# EasyEDA Pro project Development Board F.epro, schematic Schematic1
Create Date: 2023-11-21; Page Name: P1; Project Name: Development Board F-II; Schematic Name: Schematic1; Update Date: 2023-11-21; Company: 嘉立创EDA; Page Size: B; Version: V1.0
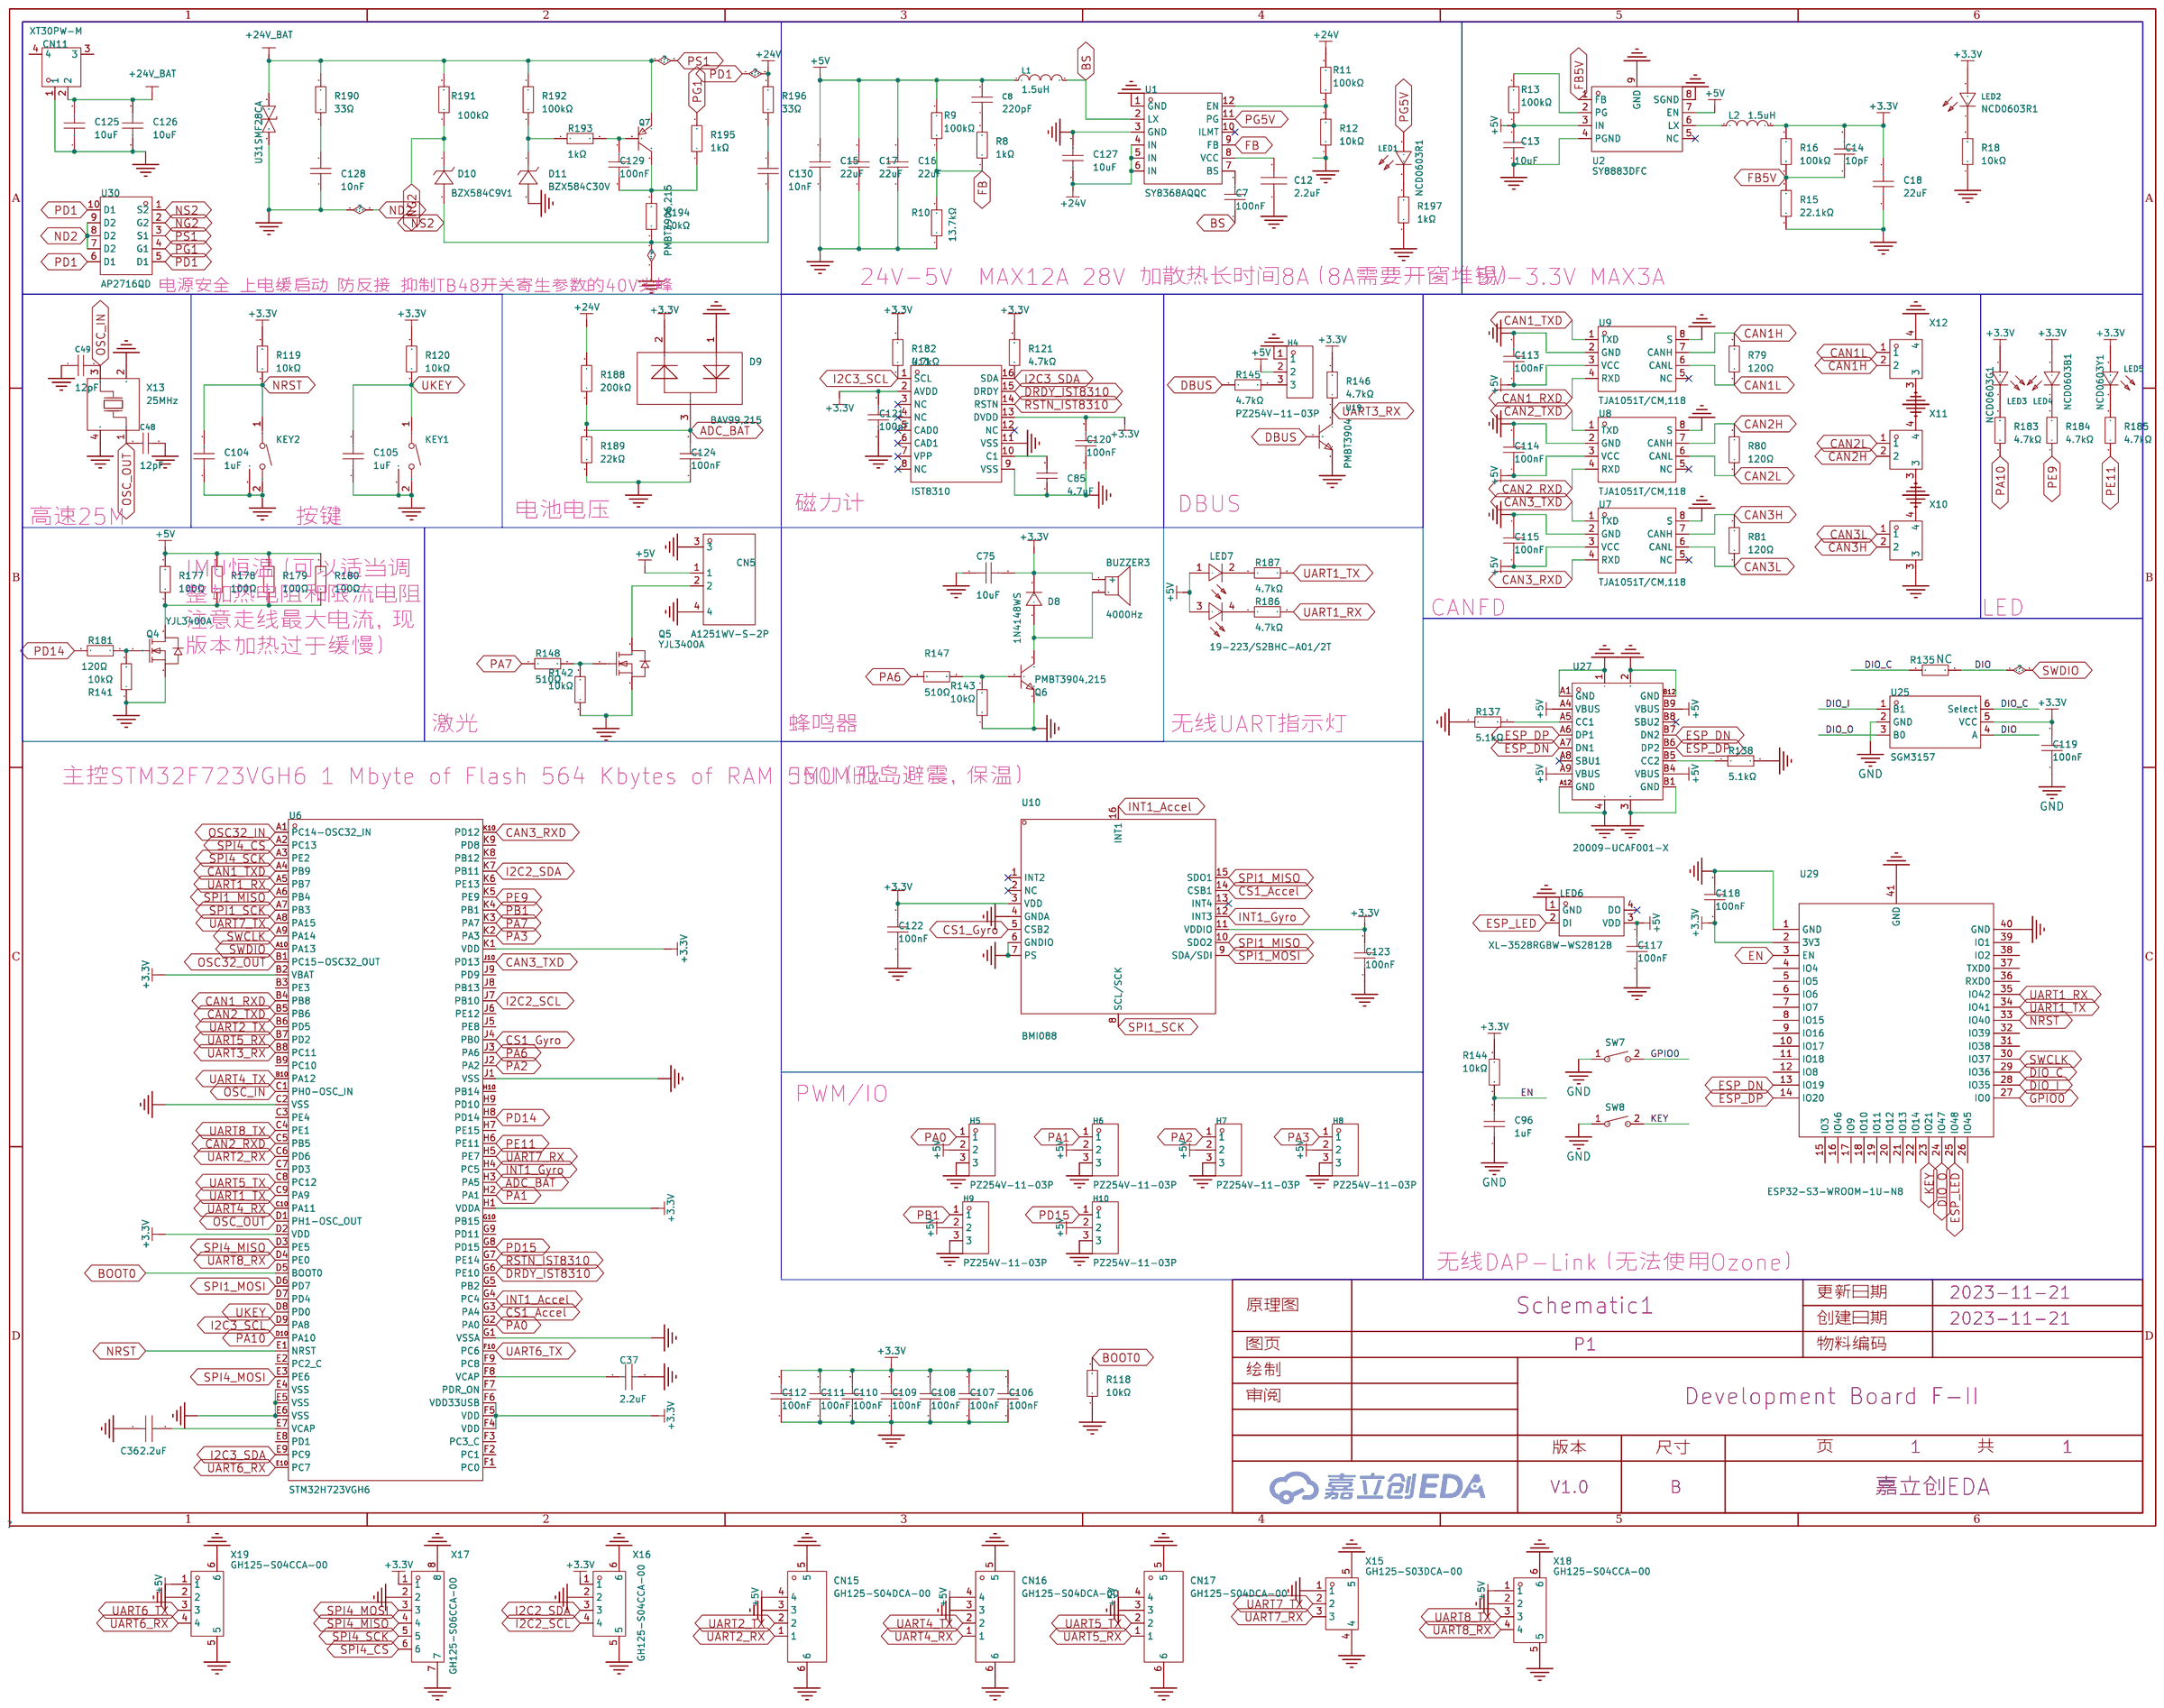
[diagram p0: schematic sheet]

## Parts
BUZZER3  4000Hz  [BUZ-SMD_L4.0-W4.0-P3.50-L]
C7  100nF  [C0402]
C8  220pF  [C0402]
C12  2.2uF  [C0402]
C13  10uF  [C0402]
C14  10pF  [C0402]
C15  22uF  [C0603]
C16  22uF  [C0603]
C17  22uF  [C0603]
C18  22uF  [C0603]
C36  2.2uF  [C0402]
C37  2.2uF  [C0402]
C48  12pF  [C0402]
C49  12pF  [C0402]
C75  10uF  [C0603]
C85  4.7uF  [C0402]
C96  1uF  [C0402]
C104  1uF  [C0402]
C105  1uF  [C0402]
C106  100nF  [C0402]
C107  100nF  [C0402]
C108  100nF  [C0402]
C109  100nF  [C0402]
C110  100nF  [C0402]
C111  100nF  [C0402]
C112  100nF  [C0402]
C113  100nF  [C0402]
C114  100nF  [C0402]
C115  100nF  [C0402]
C117  100nF  [C0402]
C118  100nF  [C0402]
C119  100nF  [C0402]
C120  100nF  [C0402]
C121  100nF  [C0402]
C122  100nF  [C0402]
C123  100nF  [C0402]
C124  100nF  [C0402]
C125  10uF  [C0805]
C126  10uF  [C0805]
C127  10uF  [C0805]
C128  10nF  [C0402]
C129  100nF  [C0402]
C130  10nF  [C0402]
CN5  A1251WV-S-2P  [CONN-SMD_2P-P1.25_A1251WV-S-2P]
CN11  XT30PW-M  [CONN-TH_XT30PW-M]
CN15  GH125-S04DCA-00  [CONN-SMD_4P-P1.27_GH125-S04DCA-00]
CN16  GH125-S04DCA-00  [CONN-SMD_4P-P1.27_GH125-S04DCA-00]
CN17  GH125-S04DCA-00  [CONN-SMD_4P-P1.27_GH125-S04DCA-00]
D8  1N4148WS  [SOD-323_L1.8-W1.3-LS2.5-RD]
D9  BAV99,215  [SOT-23-3_L2.9-W1.6-P1.90-LS2.8-BR]
D10  BZX584C9V1  [ESC_L1.2-W0.8-LS1.6-RD]
D11  BZX584C30V  [SOD-523_L1.2-W0.8-LS1.6-RD]
H4  PZ254V-11-03P  [HDR-TH_3P-P2.54-V-M]
H5  PZ254V-11-03P  [HDR-TH_3P-P2.54-V-M]
H6  PZ254V-11-03P  [HDR-TH_3P-P2.54-V-M]
H7  PZ254V-11-03P  [HDR-TH_3P-P2.54-V-M]
H8  PZ254V-11-03P  [HDR-TH_3P-P2.54-V-M]
H9  PZ254V-11-03P  [HDR-TH_3P-P2.54-V-M]
H10  PZ254V-11-03P  [HDR-TH_3P-P2.54-V-M]
KEY1  1TS003B-2500-3500A-CT  [KEY-SMD_1TS003B-2500-3500A-CT]
KEY2  1TS003B-2500-3500A-CT  [KEY-SMD_1TS003B-2500-3500A-CT]
L1  1.5uH  [IND-SMD_L7.0-W6.6]
L2  1.5uH  [L0806]
LED1  NCD0603R1  [LED0603-RD_RED]
LED2  NCD0603R1  [LED0603-RD_RED]
LED3  NCD0603G1  [LED0603-RD]
LED4  NCD0603B1  [LED0603-RD]
LED5  NCD0603Y1  [LED0603-RD]
LED6  XL-3528RGBW-WS2812B  [LED-SMD_4P-L3.5-W2.8-BR-1]
LED7  19-223/S2BHC-A01/2T  [LED-ARRAY-SMD_4P-L1.6-W1.5-BR_19-223]
Q4  YJL3400A  [SOT-23-3_L2.9-W1.3-P1.90-LS2.4-BR]
Q5  YJL3400A  [SOT-23-3_L2.9-W1.3-P1.90-LS2.4-BR]
Q6  PMBT3904,215  [SOT-23_L2.9-W1.3-P1.90-LS2.4-BR]
Q7  PMBT3906,215  [SOT-23-3_L2.9-W1.3-P1.90-LS2.4-BR]
R8  1kΩ  [R0402]
R9  100kΩ  [R0402]
R10  13.7kΩ  [R0402]
R11  100kΩ  [R0402]
R12  10kΩ  [R0402]
R13  100kΩ  [R0402]
R15  22.1kΩ  [R0402]
R16  100kΩ  [R0402]
R18  10kΩ  [R0402]
R79  120Ω  [R0402]
R80  120Ω  [R0402]
R81  120Ω  [R0402]
R118  10kΩ  [R0402]
R119  10kΩ  [R0402]
R120  10kΩ  [R0402]
R121  4.7kΩ  [R0402]
R135  NC  [R0402]
R137  5.1kΩ  [R0402]
R138  5.1kΩ  [R0402]
R141  10kΩ  [R0402]
R142  10kΩ  [R0402]
R143  10kΩ  [R0402]
R144  10kΩ  [R0402]
R145  4.7kΩ  [R0402]
R146  4.7kΩ  [R0402]
R147  510Ω  [R0402]
R148  510Ω  [R0402]
R177  100Ω  [R0603]
R178  100Ω  [R0603]
R179  100Ω  [R0603]
R180  100Ω  [R0603]
R181  120Ω  [R0402]
R182  4.7kΩ  [R0402]
R183  4.7kΩ  [R0402]
R184  4.7kΩ  [R0402]
R185  4.7kΩ  [R0402]
R186  4.7kΩ  [R0402]
R187  4.7kΩ  [R0402]
R188  200kΩ  [R0402]
R189  22kΩ  [R0402]
R190  33Ω  [R0402]
R191  100kΩ  [R0402]
R192  100kΩ  [R0402]
R193  1kΩ  [R0402]
R194  10kΩ  [R0402]
R195  1kΩ  [R0402]
R196  33Ω  [R0402]
R197  1kΩ  [R0402]
SW7  TS-1185-C-A-A-A  [SW-SMD_L4.0-W3.0-LS5.0-EH]
SW8  TS-1185-C-A-A-A  [SW-SMD_L4.0-W3.0-LS5.0-EH]
U1  SY8368AQQC  [QFN-12_L3.0-W3.0-P0.45-TL-EP]
U2  SY8883DFC  [WDFN-8_L2.0-W2.0-P0.50-BL-EP]
U6  STM32H723VGH6  [TFBGA-100_L8.0-W8.0-R10-C10-P0.80-BL]
U7  TJA1051T/CM,118  [SOIC-8_L5.0-W4.0-P1.27-LS6.1-BL]
U8  TJA1051T/CM,118  [SOIC-8_L5.0-W4.0-P1.27-LS6.1-BL]
U9  TJA1051T/CM,118  [SOIC-8_L5.0-W4.0-P1.27-LS6.1-BL]
U10  BMI088  [LGA-16_L4.5-W3.0-P0.50-BL]
U11  IST8310  [LGA-16_L3.0-W3.0-P0.5-BL]
U19  PMBT3904  [SOT-23-3_L2.9-W1.3-P1.90-LS2.4-BR]
U25  SGM3157  [SC-70-6_L2.2-W1.3-P0.65-LS2.1-BL]
U27  20009-UCAF001-X  [TYPE-C-SMD_20009-UCAF001-X]
U29  ESP32-S3-WROOM-1U-N8  [WIRELM-SMD_ESP32-S3-WROOM-1U]
U30  AP2716QD  [PDFN-8_L3.2-W3.1-P0.65-LS3.4-BL-EP2]
U31  SMF28CA  [SOD-123FL_L2.8-W1.8-LS3.7-BI]
X10  GH125-S02DCA-00  [CONN-SMD_2P-P1.25_JUSHUO_GH125-S02DCA-00]
X11  GH125-S02DCA-00  [CONN-SMD_2P-P1.25_JUSHUO_GH125-S02DCA-00]
X12  GH125-S02DCA-00  [CONN-SMD_2P-P1.25_JUSHUO_GH125-S02DCA-00]
X13  25MHz  [OSC-SMD_4P-L3.2-W2.5-BL]
X15  GH125-S03DCA-00  [CONN-SMD_3P-P1.25_JUSHUO_GH125-S03DCA-00]
X16  GH125-S04CCA-00  [CONN-SMD_4P-P1.25_JS_GH125-S04CCA-00]
X17  GH125-S06CCA-00  [CONN-SMD_6P-P1.25_JS_GH125-S06CCA-00]
X18  GH125-S04CCA-00  [CONN-SMD_4P-P1.25_JS_GH125-S04CCA-00]
X19  GH125-S04CCA-00  [CONN-SMD_4P-P1.25_JS_GH125-S04CCA-00]

## Library data of the parts
BUZZER3 = FUET-4020: 驱动方式:无源(外部驱动);构造类型:电磁式;额定电压:3V;工作电压:2V~4V;频率:4000Hz;声压(SPL):65dB@3V,10cm;长度:4mm;宽度:4mm;高度:2.5mm;; LCSC Part Name: 电压 3V 频率 4KHZ; Supplier Part: C391027; Manufacturer: FUET(福声科技); Supplier Footprint: SMD; JLCPCB Part Class: 扩展库; Datasheet: https://atta.szlcsc.com/upload/public/pdf/source/20191031/C391027_1FC1E5FCD05180B5ABC7B83EB3465454.pdf; Supplier: LCSC; Oscillator Circuit: 无源(外部驱动); Technology Type: 电磁式; Rated Voltage: 3V; Operating Voltage: 2V~4V; Sound Pressure Level (SPL): 65dB@3V,10cm; Length: 4mm; Width: 4mm; Height: 2.5mm
C7 C106-C115 C117-C124 C129 = CL05B104KB54PNC: 容值:100nF;精度:±10%;额定电压:50V;材质(温度系数):X7R;; LCSC Part Name: 100nF ±10% 50V; Supplier Part: C307331; Manufacturer: SAMSUNG(三星); Supplier Footprint: 0402; JLCPCB Part Class: 基础库; Datasheet: https://atta.szlcsc.com/upload/public/pdf/source/20181009/C307331_222F7C870FD3EA5F46F538B483443886.pdf; Supplier: LCSC; Tolerance: ±10%; Voltage Rated: 50V; Temperature Coefficient: X7R
C8 = 0402B221K500NT: 容值:220pF;精度:±10%;额定电压:50V;材质(温度系数):X7R;; LCSC Part Name: 220pF ±10% 50V; Supplier Part: C1530; Manufacturer: FH(风华); Supplier Footprint: 0402; JLCPCB Part Class: 基础库; Datasheet: https://atta.szlcsc.com/upload/public/pdf/source/20200305/C486355_26A10D38EF8C2A5C37091D0039909270.pdf; Supplier: LCSC; Tolerance: ±10%; Voltage Rated: 50V; Temperature Coefficient: X7R
C12 = CL05A225MQ5NSNC: 容值:2.2uF;精度:±20%;额定电压:6.3V;材质(温度系数):X5R;; LCSC Part Name: 2.2uF ±20% 6.3V; Supplier Part: C12530; Manufacturer: SAMSUNG(三星); Supplier Footprint: 0402; JLCPCB Part Class: 基础库; Datasheet: https://atta.szlcsc.com/upload/public/pdf/source/20160103/1457707666860.pdf; Supplier: LCSC; Tolerance: ±20%; Voltage Rated: 6.3V; Temperature Coefficient: X5R
C13 = CL05A106MQ5NUNC: 容值:10uF;精度:±20%;额定电压:6.3V;材质(温度系数):X5R;; LCSC Part Name: 10uF ±20% 6.3V; Supplier Part: C15525; Manufacturer: SAMSUNG(三星); Supplier Footprint: 0402; JLCPCB Part Class: 基础库; Datasheet: https://atta.szlcsc.com/upload/public/pdf/source/20220823/2B02EE04F8F211D38A52DCB16EB6BEBA.pdf; Supplier: LCSC; Tolerance: ±20%; Voltage Rated: 6.3V; Temperature Coefficient: X5R
C14 = CL05C100JB5NNNC: 容值:10pF;精度:±5%;额定电压:50V;材质(温度系数):C0G;; LCSC Part Name: 10pF ±5% 50V; Supplier Part: C32949; Manufacturer: SAMSUNG(三星); Supplier Footprint: 0402; JLCPCB Part Class: 基础库; Datasheet: https://atta.szlcsc.com/upload/public/pdf/source/20160103/1457707722238.pdf; Supplier: LCSC; Tolerance: ±5%; Voltage Rated: 50V; Temperature Coefficient: C0G
C15-C18 = CL10A226MQ8NRNC: 容值:22uF;精度:±20%;额定电压:6.3V;材质(温度系数):X5R;; LCSC Part Name: 22uF ±20% 6.3V; Supplier Part: C59461; Manufacturer: SAMSUNG(三星); Supplier Footprint: 0603; JLCPCB Part Class: 基础库; Datasheet: https://atta.szlcsc.com/upload/public/pdf/source/20160218/1457707763339.pdf; Supplier: LCSC; Tolerance: ±20%; Voltage Rated: 6.3V; Temperature Coefficient: X5R
C36 C37 = CL05A225MQ5NSNC: 容值:2.2uF;精度:±20%;额定电压:6.3V;材质(温度系数):X5R;; LCSC Part Name: 2.2uF ±20% 6.3V; Supplier Part: C12530; Manufacturer: SAMSUNG(三星); Supplier Footprint: 0402; JLCPCB Part Class: Basic Part; Datasheet: https://atta.szlcsc.com/upload/public/pdf/source/20160103/1457707666860.pdf; Supplier: LCSC; Tolerance: ±20%; Voltage Rated: 6.3V; Temperature Coefficient: X5R
C48 C49 = 0402CG120J500NT: 容值:12pF;精度:±5%;额定电压:50V;材质(温度系数):C0G;; LCSC Part Name: 12pF ±5% 50V; Supplier Part: C1547; Manufacturer: FH(风华); Supplier Footprint: 0402; JLCPCB Part Class: Basic Part; Datasheet: https://atta.szlcsc.com/upload/public/pdf/source/20200305/C486355_26A10D38EF8C2A5C37091D0039909270.pdf; Supplier: LCSC; Tolerance: ±5%; Voltage Rated: 50V; Temperature Coefficient: C0G
C75 = CL10A106MA8NRNC: 容值:10uF;精度:±20%;额定电压:25V;材质(温度系数):X5R;; LCSC Part Name: 10uF ±20% 25V; Supplier Part: C96446; Manufacturer: SAMSUNG(三星); Supplier Footprint: 0603; JLCPCB Part Class: 基础库; Datasheet: https://atta.szlcsc.com/upload/public/pdf/source/20170325/1490427913016.pdf; Supplier: LCSC; Tolerance: ±20%; Voltage Rated: 25V; Temperature Coefficient: X5R
C85 = CL05A475MP5NRNC: 容值:4.7uF;精度:±20%;额定电压:10V;材质(温度系数):X5R;; LCSC Part Name: 4.7uF ±20% 10V; Supplier Part: C23733; Manufacturer: SAMSUNG(三星); Supplier Footprint: 0402; JLCPCB Part Class: 基础库; Datasheet: https://atta.szlcsc.com/upload/public/pdf/source/20160103/1457707710457.pdf; Supplier: LCSC; Tolerance: ±20%; Voltage Rated: 10V; Temperature Coefficient: X5R
C96 C104 C105 = CL05A105KA5NQNC: 容值:1uF;精度:±10%;额定电压:25V;材质(温度系数):X5R;; LCSC Part Name: 1uF ±10% 25V; Supplier Part: C52923; Manufacturer: SAMSUNG(三星); Supplier Footprint: 0402; JLCPCB Part Class: 基础库; Datasheet: https://atta.szlcsc.com/upload/public/pdf/source/20160103/1457707735223.pdf; Supplier: LCSC; Tolerance: ±10%; Voltage Rated: 25V; Temperature Coefficient: X5R
C125-C127 = GRM21BR61H106KE43L: 容值:10uF;精度:±10%;额定电压:50V;材质(温度系数):X5R;; LCSC Part Name: 10uF ±10% 50V; Supplier Part: C440198; Manufacturer: muRata(村田); Supplier Footprint: 0805; JLCPCB Part Class: 基础库; Datasheet: https://atta.szlcsc.com/upload/public/pdf/source/20191220/C440198_2DEA1B9834E321C8893F7972E9DFE5B0.pdf; Supplier: LCSC; Tolerance: ±10%; Voltage Rated: 50V; Temperature Coefficient: X5R
C128 C130 = CL05B103KB5NNNC: 容值:10nF;精度:±10%;额定电压:50V;材质(温度系数):X7R;; LCSC Part Name: 10nF ±10% 50V; Supplier Part: C15195; Manufacturer: SAMSUNG(三星); Supplier Footprint: 0402; JLCPCB Part Class: 基础库; Datasheet: https://atta.szlcsc.com/upload/public/pdf/source/20160103/1457707674468.pdf; Supplier: LCSC; Tolerance: ±10%; Voltage Rated: 50V; Temperature Coefficient: X7R
CN5 = A1251WV-S-2P: 参考系列:-;间距:1.25mm;插针结构:1x2P;排数:1;每排PIN数:2;行距:-;安装方式:-;触头材质:磷青铜;; LCSC Part Name: 1.25mm 1x2P 镀锡; Supplier Part: C225104; Manufacturer: CJT(长江连接器); Supplier Footprint: SMD,P=1.25mm; JLCPCB Part Class: 扩展库; Datasheet: https://atta.szlcsc.com/upload/public/pdf/source/20180509/C225104_35B4868FFB7D8A864E1EEFC552D9B5A2.pdf; Supplier: LCSC; Pitch: 1.25mm; Pins Structure: 1x2P; Number of Rows: 1; Number of PINs Per Row: 2; Contact Material: 磷青铜
CN11 = XT30PW-M: Socket,DCsupply,XT30,male,PIN:2; LCSC Part Name: AMASS(艾迈斯)航模插头 卧式弯脚 XT30PW-M公头; Supplier Part: C431092; Manufacturer: AMASS(艾迈斯); JLCPCB Part Class: Extended Part; Datasheet: https://atta.szlcsc.com/upload/public/pdf/source/20220222/6A9F22F7850E25B33E1BE430ADF8560B.pdf; Supplier: LCSC
CN15-CN17 = GH125-S04DCA-00: 参考系列:-;间距:1.25mm;插针结构:1x4P;排数:1;每排PIN数:4;行距:-;公母:公型插针;安装方式:卧贴;额定电流:1A;工作温度范围:-25℃~+85℃;; LCSC Part Name: GH1.25卧式贴片 带扣; Supplier Part: C2886767; Manufacturer: JS(钜硕电子); Supplier Footprint: SMD,P=1.25mm; JLCPCB Part Class: 扩展库; Datasheet: https://atta.szlcsc.com/upload/public/pdf/source/20210818/CD11791E5ED3EDF45A7009E9C8A2BD4C.pdf; Supplier: LCSC; Pitch: 1.25mm; Pins Structure: 1x4P; Number of Rows: 1; Number of PINs Per Row: 4; Gender: 公型插针; Mounting Style: 卧贴; Current Rating (Max): 1A; Operating Temperature Range: -25℃~+85℃
D8 = 1N4148WS_C2128: 二极管配置:独立式;功率:200mW;直流反向耐压(Vr):100V;平均整流电流(Io):150mA;正向压降(Vf):1.25V@150mA;反向电流(Ir):1uA@75V;反向恢复时间(trr):4ns;工作温度:+150℃@(Tj);; LCSC Part Name: 100V 150mA 4ns T4; Supplier Part: C2128; Manufacturer: CJ(江苏长电/长晶); Supplier Footprint: SOD-323; JLCPCB Part Class: 基础库; Datasheet: https://atta.szlcsc.com/upload/public/pdf/source/20140809/1457707208178.pdf; Supplier: LCSC; Diode Configuration: 独立式; Power Dissipation: 200mW; Reverse Voltage (Vr): 100V; Average Rectified Current (Io): 150mA; Forward Voltage (Vf@If): 1.25V@150mA; Reverse Leakage Current: 1uA@75V; Reverse Recovery Time (trr): 4ns; Operating Temperature: +150℃@(Tj)
D9 = BAV99,215: 二极管配置:1对串联式;功率:250mW;直流反向耐压(Vr):100V;平均整流电流(Io):215mA;正向压降(Vf):1.25V@150mA;反向恢复时间(trr):4ns;; LCSC Part Name: 100V 215mA 1.25V@150mA; Supplier Part: C2500; Manufacturer: Nexperia(安世); Supplier Footprint: SOT-23; JLCPCB Part Class: 基础库; Datasheet: https://atta.szlcsc.com/upload/public/pdf/source/20151007/1457707426030.pdf; Supplier: LCSC; Diode Configuration: 1对串联式; Power Dissipation: 250mW; Reverse Voltage (Vr): 100V; Average Rectified Current (Io): 215mA; Forward Voltage (Vf@If): 1.25V@150mA; Reverse Leakage Current: 500nA@80V; Reverse Recovery Time (trr): 4ns; Operating Temperature: +150℃@(Tj)
D10 = BZX584C9V1: 二极管配置:独立式;稳压值(标称值):9.1V;稳压值(范围):8.5V~9.6V;精度:-;功率:200mW;反向电流(Ir):200nA@7V;阻抗(Zzt):15Ω;; LCSC Part Name: 9.1V 200mW; Supplier Part: C968211; Manufacturer: YANGJIE(扬杰); Supplier Footprint: SOD-523; JLCPCB Part Class: 扩展库; Datasheet: https://atta.szlcsc.com/upload/public/pdf/source/20201222/C968180_8DEF4A0FE776E72B62938E062B6263B6.pdf; Supplier: LCSC; Diode Configuration: 独立式; Zener Voltage (Nom): 9.1V; Zener Voltage (Range): 8.5V~9.6V; Power Dissipation: 200mW; Reverse Leakage Current (Ir): 200nA@7V; Zener Impedance (Zzt): 15Ω
D11 = BZX584C30V: 二极管配置:独立式;稳压值(标称值):30V;稳压值(范围):28V~32V;精度:-;功率:200mW;反向电流(Ir):50nA@21V;阻抗(Zzt):80Ω;; LCSC Part Name: 30V 200mW; Supplier Part: C968193; Manufacturer: YANGJIE(扬杰); Supplier Footprint: SOD-523; JLCPCB Part Class: 扩展库; Datasheet: https://atta.szlcsc.com/upload/public/pdf/source/20201222/C968180_8DEF4A0FE776E72B62938E062B6263B6.pdf; Supplier: LCSC; Diode Configuration: 独立式; Zener Voltage (Nom): 30V; Zener Voltage (Range): 28V~32V; Power Dissipation: 200mW; Reverse Leakage Current (Ir): 50nA@21V; Zener Impedance (Zzt): 80Ω
H4-H10 = PZ254V-11-03P: 排数:单排;总PIN位数:3;间距:2.54mm;插针结构:1x3P;行距:-;安装类型:直插;圆针/方针:方针;额定电流:3A;额定电压:250V;配合针长度:6mm;塑高:2.5mm;端接针长度:3mm;工作温度范围:-40℃~+105℃;颜色:黑色;; LCSC Part Name: 2.54mm 1x3P 直插 方针; Supplier Part: C2937625; Manufacturer: XFCN(兴飞); Supplier Footprint: 直插,P=2.54mm; JLCPCB Part Class: 扩展库; Datasheet: 2022-07-12/581362A/62b9d00620994b3696be7eb4af85ad72/双排排针和单排排针.pdf; Supplier: LCSC; Number of Rows: 单排; Number of Pins: 3; Pitch: 2.54mm; Pin Structure: 1x3P; Mounting Type: 直插; Circluar Pins/Square Pins: 方针; Current Rating (Max): 3A; Voltage Rating (Max): 250V; Length of Mating Pin: 6mm; Insulation Height: 2.5mm; Length of End Connection Pin: 3mm; Operating Temperature Range: -40℃~+105℃; Color: 黑色
KEY1 KEY2 = 1TS003B-2500-3500A-CT: 触点电流:50mA;额定电压(DC):12V;额定功率:0.6W;绝缘电阻:100MΩ;电路结构:单刀单掷;安装方式:卧贴;带灯:无;作用力:250gf@±50gf;机械寿命:1.5万次;带支架:否;; LCSC Part Name: 4.6*1.82*3.5mm 卧贴 轻触开关; Supplier Part: C255810; Manufacturer: HYP(鸿源精密); Supplier Footprint: SMD,2x4mm; JLCPCB Part Class: 扩展库; Datasheet: https://atta.szlcsc.com/upload/public/pdf/source/20180720/C255810_F77B30B42331AEA91D48A1AA0FBA2945.pdf; Supplier: LCSC; Contact Current: 50mA; Voltage Rating (DC): 12V; Power Rating: 0.6W; Insulation Resistance: 100MΩ; Circuit: 单刀单掷; Mounting Style: 卧贴; Actuator Style: 矩形按钮; Actuator/Cap Color: 黑色; With Lamp: 无; Operating Force: 250gf@±50gf; Mechanical Life: 1.5万次; Operating Temperature: -40℃~+90℃; Pin Style: J型引脚; Switch Length: 4.6mm; Switch Width: 1.82mm; Switch Height: 3.5mm; Strike Gundam: 否
L1 = FXL0624-1R5-M: 类型:一体成型电感;电感值:1.5uH;精度:±20%;额定电流:9A;饱和电流(Isat):15A;; LCSC Part Name: 1.5uH ±20% 15A; Supplier Part: C524603; Manufacturer: cjiang(长江微电); Supplier Footprint: SMD,6.6x7mm; JLCPCB Part Class: 扩展库; Datasheet: https://atta.szlcsc.com/upload/public/pdf/source/20230516/0866C3D179493295F2274FDF9DB6F780.pdf; Supplier: LCSC; Type: 一体成型电感; Tolerance: ±20%; Rated Current: 9A; Saturation Current (Isat): 15A; DC Resistance (DCR): 20mΩ
L2 = DFE201610E-1R5M=P2: 电感值:1.5uH;精度:±20%;额定电流:-;饱和电流(Isat):-;; LCSC Part Name: 1.5uH ±20%; Supplier Part: C668311; Manufacturer: muRata(村田); Supplier Footprint: SMD; JLCPCB Part Class: 扩展库; Datasheet: https://atta.szlcsc.com/upload/public/pdf/source/20190513/C337891_E8F53E7A275D0CF4365E41AA9943B04D.pdf; Supplier: LCSC; Tolerance: ±20%
LED1 LED2 = NCD0603R1_C84263: 发光颜色:红灯;; LCSC Part Name: 红灯 0603红灯   正贴; Supplier Part: C84263; Manufacturer: 国星光电; Supplier Footprint: 0603; JLCPCB Part Class: 扩展库; Datasheet: https://atta.szlcsc.com/upload/public/pdf/source/20200820/C84263_DABC6A75E58F576973B407FDBA283D60.pdf; Supplier: LCSC; Emitted Color: 红灯
LED3 = NCD0603G1: 发光颜色:翠绿;; LCSC Part Name: 翠绿 0603翠绿  正贴; Supplier Part: C84267; Manufacturer: 国星光电; Supplier Footprint: 0603; JLCPCB Part Class: 扩展库; Datasheet: https://atta.szlcsc.com/upload/public/pdf/source/20200820/C84267_04BA7703640BAC111D09F5EFB971FBF3.pdf; Supplier: LCSC; Emitted Color: 翠绿
LED4 = NCD0603B1: 发光颜色:蓝灯;; LCSC Part Name: 蓝灯; Supplier Part: C84266; Manufacturer: 国星光电; Supplier Footprint: 0603; JLCPCB Part Class: 扩展库; Datasheet: https://atta.szlcsc.com/upload/public/pdf/source/20200820/C84266_6A3CDBEFA72C6CAD68EDA53474ADAE6C.pdf; Supplier: LCSC; Emitted Color: 蓝灯
LED5 = NCD0603Y1: 发光颜色:黄灯;; Supplier Part: C84268; Manufacturer: 国星光电; Supplier Footprint: 0603; JLCPCB Part Class: 扩展库; Datasheet: https://atta.szlcsc.com/upload/public/pdf/source/20200820/C84268_8FC106CB292CF978F9CFC6892464F83C.pdf; Supplier: LCSC; Emitted Color: 黄灯
LED6 = XL-3528RGBW-WS2812B: 发光颜色:RGB三色;二极管配置:-;主波长:618nm~623nm；520nm~525nm；467nm~472nm;功率:50mW；50mW；45mW;安装方式:正贴;; LCSC Part Name: RGB三色 正贴 幻彩; Supplier Part: C2890364; Manufacturer: XINGLIGHT(成兴光); Supplier Footprint: SMD3528-4P; JLCPCB Part Class: 扩展库; Datasheet: https://atta.szlcsc.com/upload/public/pdf/source/20221102/50F456983F591359B0D81AA557777463.pdf; Supplier: LCSC; Emitted Color: RGB三色; Dominant Wavelength: 618nm~623nm；520nm~525nm；467nm~472nm; Peak Wavelength: 525nm；623nm；472nm; Forward Current: 20mA; Power Dissipation: 50mW；50mW；45mW; Viewing Angle: 120°; Mounting Sytle: 正贴; Operating Temperature: -25℃~+80℃
LED7 = 19-223/S2BHC-A01/2T: 发光颜色:橙灯,蓝灯;二极管配置:-;透镜颜色:无色透明;主波长:470nm；605nm;色温:-;功率:60mW；75mW;发光角度:120°;安装方式:-;工作温度:-40℃~+85℃;; LCSC Part Name: 橙灯,蓝灯; Supplier Part: C883171; Manufacturer: EVERLIGHT(亿光); Supplier Footprint: 0606; JLCPCB Part Class: 扩展库; Datasheet: https://atta.szlcsc.com/upload/public/pdf/source/20201103/C883171_5F9DC7D6FE738F23ABB8905D22F05F10.pdf; Supplier: LCSC; Emitted Color: 橙灯,蓝灯; Lens Color: 无色透明; Dominant Wavelength: 470nm；605nm; Peak Wavelength: 611nm；468nm; Forward Current: 20mA; Power Dissipation: 60mW；75mW; Viewing Angle: 120°; Operating Temperature: -40℃~+85℃
Q4 Q5 = YJL3400A: 类型:N沟道;漏源电压(Vdss):30V;连续漏极电流(Id):5.6A;功率(Pd):1.2W;导通电阻(RDS(on)@Vgs,Id):27mΩ@10V,5.6A;; LCSC Part Name: N沟道 30V 5.6A; Supplier Part: C699302; Manufacturer: YANGJIE(扬杰); Supplier Footprint: SOT-23-3L; JLCPCB Part Class: 扩展库; Datasheet: https://atta.szlcsc.com/upload/public/pdf/source/20200709/C699302_C2B88B69139871D2E58BC98BB548FF51.pdf; Supplier: LCSC; Type: N沟道; Drain Source Voltage (Vdss): 30V; Continuous Drain Current (Id): 5.6A; Power Dissipation (Pd): 1.2W; Drain Source On Resistance (RDS(on)@Vgs,Id): 27mΩ@10V,5.6A; Gate Threshold Voltage (Vgs(th)@Id): 1.5V@250uA
Q6 = PMBT3904,215: 晶体管类型:NPN;集射极击穿电压(Vceo):40V;集电极电流(Ic):200mA;功率(Pd):250mW;直流电流增益(hFE@Ic,Vce):100@10mA,1V;; LCSC Part Name: NPN 40V 200mA; Supplier Part: C8667; Manufacturer: Nexperia(安世); Supplier Footprint: SOT-23; JLCPCB Part Class: 扩展库; Datasheet: https://atta.szlcsc.com/upload/public/pdf/source/20210520/C8667_82CC4B18F957EC74ED6E8B4E120941E6.pdf; Supplier: LCSC; Transistor Type: NPN; Collector-Emitter Breakdown Voltage (Vceo): 40V; Collector Current (Ic): 200mA; Power Dissipation (Pd): 250mW; Collector Cut-Off Current (Icbo): 50nA; Collector-Emitter Saturation Voltage (VCE(sat)@Ic,Ib): 300mV@50mA,5mA; DC Current Gain (hFE@Ic,Vce): 100@10mA,1V; Transition Frequency (fT): 300MHz; Operating Temperature: +150℃@(Tj)
Q7 = PMBT3906,215: 晶体管类型:PNP;集射极击穿电压(Vceo):40V;集电极电流(Ic):200mA;功率(Pd):250mW;直流电流增益(hFE@Ic,Vce):100@10mA,1V;; LCSC Part Name: PNP 40V 200mA; Supplier Part: C8670; Manufacturer: Nexperia(安世); Supplier Footprint: SOT-23; JLCPCB Part Class: 扩展库; Datasheet: https://atta.szlcsc.com/upload/public/pdf/source/20130412/1457706600965.pdf; Supplier: LCSC; Transistor Type: PNP; Collector-Emitter Breakdown Voltage (Vceo): 40V; Collector Current (Ic): 200mA; Power Dissipation (Pd): 250mW; Collector Cut-Off Current (Icbo): 50nA; Collector-Emitter Saturation Voltage (VCE(sat)@Ic,Ib): 400mV@50mA,5mA; DC Current Gain (hFE@Ic,Vce): 100@10mA,1V; Transition Frequency (fT): 250MHz; Operating Temperature: +150℃@(Tj)
R8 R193 R195 R197 = 0402WGF1001TCE: 电阻类型:厚膜电阻;阻值:1kΩ;精度:±1%;功率:62.5mW;; LCSC Part Name: 1kΩ ±1% 62.5mW; Supplier Part: C11702; Manufacturer: UNI-ROYAL(厚声); Supplier Footprint: 0402; JLCPCB Part Class: 基础库; Datasheet: https://atta.szlcsc.com/upload/public/pdf/source/20200306/C422600_1E6D84923E4A46A82E41ADD87F860B5C.pdf; Supplier: LCSC; Type: 厚膜电阻; Tolerance: ±1%; Power(Watts): 62.5mW; Temperature Coefficient: ±100ppm/℃; Overload Voltage (Max): 50V; Operating Temperature Range: -55℃~+155℃
R9 R11 R13 R16 R191 R192 = 0402WGF1003TCE: 电阻类型:厚膜电阻;阻值:100kΩ;精度:±1%;功率:62.5mW;; LCSC Part Name: 100kΩ ±1% 62.5mW; Supplier Part: C25741; Manufacturer: UNI-ROYAL(厚声); Supplier Footprint: 0402; JLCPCB Part Class: 基础库; Datasheet: https://atta.szlcsc.com/upload/public/pdf/source/20200306/C422600_1E6D84923E4A46A82E41ADD87F860B5C.pdf; Supplier: LCSC; Type: 厚膜电阻; Tolerance: ±1%; Power(Watts): 62.5mW; Temperature Coefficient: ±100ppm/℃; Overload Voltage (Max): 50V; Operating Temperature Range: -55℃~+155℃
R10 = 0402WGF1372TCE: 电阻类型:厚膜电阻;阻值:13.7kΩ;精度:±1%;功率:62.5mW;温度系数:±100ppm/℃;; LCSC Part Name: 厚膜电阻 13.7kΩ ±1% 62.5mW; Supplier Part: C25854; Manufacturer: UNI-ROYAL(厚声); Supplier Footprint: 0402; JLCPCB Part Class: Extended Part; Datasheet: https://atta.szlcsc.com/upload/public/pdf/source/20200306/C422600_1E6D84923E4A46A82E41ADD87F860B5C.pdf; Supplier: LCSC; Type: 厚膜电阻; Tolerance: ±1%; Power(Watts): 62.5mW; Temperature Coefficient: ±100ppm/℃; Overload Voltage (Max): 50V; Operating Temperature Range: -55℃~+155℃
R12 R18 R118-R120 R194 = 0402WGF1002TCE: 电阻类型:厚膜电阻;阻值:10kΩ;精度:±1%;功率:62.5mW;温度系数:±100ppm/℃;; LCSC Part Name: 厚膜电阻 10kΩ ±1% 62.5mW; Supplier Part: C25744; Manufacturer: UNI-ROYAL(厚声); Supplier Footprint: 0402; JLCPCB Part Class: 基础库; Datasheet: https://atta.szlcsc.com/upload/public/pdf/source/20200306/C422600_1E6D84923E4A46A82E41ADD87F860B5C.pdf; Supplier: LCSC; Type: 厚膜电阻; Tolerance: ±1%; Power(Watts): 62.5mW; Temperature Coefficient: ±100ppm/℃; Overload Voltage (Max): 50V; Operating Temperature Range: -55℃~+155℃
R15 = 0402WGF2212TCE: 电阻类型:厚膜电阻;阻值:22.1kΩ;精度:±1%;功率:62.5mW;; LCSC Part Name: 22.1kΩ ±1% 62.5mW; Supplier Part: C43473; Manufacturer: UNI-ROYAL(厚声); Supplier Footprint: 0402; JLCPCB Part Class: Extended Part; Datasheet: https://atta.szlcsc.com/upload/public/pdf/source/20200306/C422600_1E6D84923E4A46A82E41ADD87F860B5C.pdf; Supplier: LCSC; Type: 厚膜电阻; Tolerance: ±1%; Power(Watts): 62.5mW; Temperature Coefficient: ±100ppm/℃; Overload Voltage (Max): 50V; Operating Temperature Range: -55℃~+155℃
R79-R81 R181 = 0402WGF1200TCE: 电阻类型:厚膜电阻;阻值:120Ω;精度:±1%;功率:62.5mW;; LCSC Part Name: 120Ω ±1% 62.5mW; Supplier Part: C25079; Manufacturer: UNI-ROYAL(厚声); Supplier Footprint: 0402; JLCPCB Part Class: 基础库; Datasheet: https://atta.szlcsc.com/upload/public/pdf/source/20200306/C422600_1E6D84923E4A46A82E41ADD87F860B5C.pdf; Supplier: LCSC; Type: 厚膜电阻; Tolerance: ±1%; Power(Watts): 62.5mW; Temperature Coefficient: ±100ppm/℃; Overload Voltage (Max): 50V; Operating Temperature Range: -55℃~+155℃
R121 R182-R187 = 0402WGF4701TCE: 电阻类型:厚膜电阻;阻值:4.7kΩ;精度:±1%;功率:62.5mW;; LCSC Part Name: 4.7kΩ ±1% 62.5mW; Supplier Part: C25900; Manufacturer: UNI-ROYAL(厚声); Supplier Footprint: 0402; JLCPCB Part Class: 基础库; Datasheet: https://atta.szlcsc.com/upload/public/pdf/source/20200306/C422600_1E6D84923E4A46A82E41ADD87F860B5C.pdf; Supplier: LCSC; Type: 厚膜电阻; Tolerance: ±1%; Power(Watts): 62.5mW; Temperature Coefficient: ±100ppm/℃; Overload Voltage (Max): 50V; Operating Temperature Range: -55℃~+155℃
R135 = R0402
R137 R138 = 0402WGF5101TCE: 电阻类型:厚膜电阻;阻值:5.1kΩ;精度:±1%;功率:62.5mW;; LCSC Part Name: 5.1kΩ ±1% 62.5mW; Supplier Part: C25905; Manufacturer: UNI-ROYAL(厚声); Supplier Footprint: 0402; JLCPCB Part Class: Basic Part; Datasheet: https://atta.szlcsc.com/upload/public/pdf/source/20200306/C422600_1E6D84923E4A46A82E41ADD87F860B5C.pdf; Supplier: LCSC; Type: 厚膜电阻; Tolerance: ±1%; Power(Watts): 62.5mW; Temperature Coefficient: ±100ppm/℃; Overload Voltage (Max): 50V; Operating Temperature Range: -55℃~+155℃
R141-R144 = 0402WGF1002TCE: 电阻类型:厚膜电阻;阻值:10kΩ;精度:±1%;功率:62.5mW;; LCSC Part Name: 10kΩ ±1% 62.5mW; Supplier Part: C25744; Manufacturer: UNI-ROYAL(厚声); Supplier Footprint: 0402; JLCPCB Part Class: 基础库; Datasheet: https://atta.szlcsc.com/upload/public/pdf/source/20200306/C422600_1E6D84923E4A46A82E41ADD87F860B5C.pdf; Supplier: LCSC; Type: 厚膜电阻; Tolerance: ±1%; Power(Watts): 62.5mW; Temperature Coefficient: ±100ppm/℃; Overload Voltage (Max): 50V; Operating Temperature Range: -55℃~+155℃
R145 R146 = 0402WGF4701TCE: 电阻类型:厚膜电阻;阻值:4.7kΩ;精度:±1%;功率:62.5mW;; LCSC Part Name: 4.7kΩ ±1% 62.5mW; Supplier Part: C25900; Manufacturer: UNI-ROYAL(厚声); Supplier Footprint: 0402; JLCPCB Part Class: Basic Part; Datasheet: https://atta.szlcsc.com/upload/public/pdf/source/20200306/C422600_1E6D84923E4A46A82E41ADD87F860B5C.pdf; Supplier: LCSC; Type: 厚膜电阻; Tolerance: ±1%; Power(Watts): 62.5mW; Temperature Coefficient: ±100ppm/℃; Overload Voltage (Max): 50V; Operating Temperature Range: -55℃~+155℃
R147 R148 = 0402WGF5100TCE: 电阻类型:厚膜电阻;阻值:510Ω;精度:±1%;功率:62.5mW;; LCSC Part Name: 510Ω ±1% 62.5mW; Supplier Part: C25123; Manufacturer: UNI-ROYAL(厚声); Supplier Footprint: 0402; JLCPCB Part Class: Basic Part; Datasheet: https://atta.szlcsc.com/upload/public/pdf/source/20200306/C422600_1E6D84923E4A46A82E41ADD87F860B5C.pdf; Supplier: LCSC; Type: 厚膜电阻; Tolerance: ±1%; Power(Watts): 62.5mW; Temperature Coefficient: ±100ppm/℃; Overload Voltage (Max): 50V; Operating Temperature Range: -55℃~+155℃
R177-R180 = 0603WAF1000T5E: 电阻类型:厚膜电阻;阻值:100Ω;精度:±1%;功率:100mW;温度系数:±200ppm/℃;; LCSC Part Name: 厚膜电阻 100Ω ±1% 100mW; Supplier Part: C22775; Manufacturer: UNI-ROYAL(厚声); Supplier Footprint: 0603; JLCPCB Part Class: 基础库; Datasheet: https://atta.szlcsc.com/upload/public/pdf/source/20200306/C422600_1E6D84923E4A46A82E41ADD87F860B5C.pdf; Supplier: LCSC; Type: 厚膜电阻; Tolerance: ±1%; Power(Watts): 100mW; Temperature Coefficient: ±200ppm/℃; Overload Voltage (Max): 75V; Operating Temperature Range: -55℃~+155℃
R188 = 0402WGF2003TCE: 电阻类型:厚膜电阻;阻值:200kΩ;精度:±1%;功率:62.5mW;温度系数:±100ppm/℃;; LCSC Part Name: 厚膜电阻 200kΩ ±1% 62.5mW; Supplier Part: C25764; Manufacturer: UNI-ROYAL(厚声); Supplier Footprint: 0402; JLCPCB Part Class: 基础库; Datasheet: https://atta.szlcsc.com/upload/public/pdf/source/20200306/C422600_1E6D84923E4A46A82E41ADD87F860B5C.pdf; Supplier: LCSC; Type: 厚膜电阻; Tolerance: ±1%; Power(Watts): 62.5mW; Temperature Coefficient: ±100ppm/℃; Overload Voltage (Max): 50V; Operating Temperature Range: -55℃~+155℃
R189 = 0402WGF2202TCE: 电阻类型:厚膜电阻;阻值:22kΩ;精度:±1%;功率:62.5mW;温度系数:±100ppm/℃;; LCSC Part Name: 厚膜电阻 22kΩ ±1% 62.5mW; Supplier Part: C25768; Manufacturer: UNI-ROYAL(厚声); Supplier Footprint: 0402; JLCPCB Part Class: 基础库; Datasheet: https://atta.szlcsc.com/upload/public/pdf/source/20200306/C422600_1E6D84923E4A46A82E41ADD87F860B5C.pdf; Supplier: LCSC; Type: 厚膜电阻; Tolerance: ±1%; Power(Watts): 62.5mW; Temperature Coefficient: ±100ppm/℃; Overload Voltage (Max): 50V; Operating Temperature Range: -55℃~+155℃
R190 R196 = 0402WGF330JTCE: 电阻类型:厚膜电阻;阻值:33Ω;精度:±1%;功率:62.5mW;温度系数:±100ppm/℃;; LCSC Part Name: 厚膜电阻 33Ω ±1% 62.5mW; Supplier Part: C25105; Manufacturer: UNI-ROYAL(厚声); Supplier Footprint: 0402; JLCPCB Part Class: 基础库; Datasheet: https://atta.szlcsc.com/upload/public/pdf/source/20200306/C422600_1E6D84923E4A46A82E41ADD87F860B5C.pdf; Supplier: LCSC; Type: 厚膜电阻; Tolerance: ±1%; Power(Watts): 62.5mW; Temperature Coefficient: ±100ppm/℃; Overload Voltage (Max): 50V; Operating Temperature Range: -55℃~+155℃
SW7 SW8 = TS-1185-C-A-A-A: 触点电流:50mA;额定电压(DC):12V;绝缘电阻:-;电路结构:单刀单掷;安装方式:立贴;带灯:无;作用力:260gf;机械寿命:10万次;带支架:否;; LCSC Part Name: 4*3*2mm 立贴 轻触开关; Supplier Part: C561518; Manufacturer: XKB Connectivity(中国星坤); Supplier Footprint: SMD; JLCPCB Part Class: Extended Part; Datasheet: https://atta.szlcsc.com/upload/public/pdf/source/20211011/C2F26DC0AE1820400F54DBF49644F5A1.pdf; Supplier: LCSC; Contact Current: 50mA; Voltage Rating (DC): 12V; Circuit: 单刀单掷; Mounting Style: 立贴; Actuator Style: 圆形按钮; Actuator/Cap Color: 黑色; With Lamp: 无; Operating Force: 260gf; Mechanical Life: 10万次; Operating Temperature: -30℃~+85℃; Switch Length: 4mm; Switch Width: 3mm; Switch Height: 2mm; Strike Gundam: 否
U1 = SY8368AQQC: Supplier Part: C207642; Manufacturer: silergy(矽力杰); Supplier Footprint: QFN-12(3x3); JLCPCB Part Class: 扩展库; Datasheet: https://atta.szlcsc.com/upload/public/pdf/source/20230216/4232C0095630C5F8359F22493EDE685C.pdf; Supplier: LCSC
U2 = SY8883DFC: Supplier Part: C3029184; Manufacturer: silergy(矽力杰); Supplier Footprint: DFN-8(2x2); JLCPCB Part Class: 扩展库; Datasheet: https://atta.szlcsc.com/upload/public/pdf/source/20220614/20054F03FB9FDBFE0401696D134E2D98.pdf; Supplier: LCSC
U6 = STM32H723VGH6: 应用领域:-;CPU内核:ARM-M系列;CPU最大主频:550MHz;工作电压范围:1.62V~3.6V;程序存储容量:1MB;程序存储器类型:-;RAM总容量:-;GPIO端口数量:80;; LCSC Part Name: ARM-M系列 550MHz; Supplier Part: C2848033; Manufacturer: ST(意法半导体); Supplier Footprint: TFBGA-100(8x8x0.8); JLCPCB Part Class: 扩展库; Datasheet: https://atta.szlcsc.com/upload/public/pdf/source/20221107/3FC9BFF347BA16183E5CC96DF77651E2.pdf; Supplier: LCSC; CPU Core: ARM-M系列; CPU Maximum Speed: 550MHz; Operating Voltage Range: 1.62V~3.6V; Program Storage Size: 1MB; GPIO Ports Number: 80; 16Bit Timer: 10; 32Bit Timer: 4; I2C: 4; I2S: 5; SPI: 5; Universal Serial Bus: 有; Watchdog: 有; Real-Time Clock: 有; Low-Voltage Detect: 有; Operating Temperature Range: -40℃~+125℃
U7-U9 = TJA1051T/CM,118: Supplier Part: C2859133; Manufacturer: NXP(恩智浦); Supplier Footprint: SOIC-8; JLCPCB Part Class: 扩展库; Datasheet: https://atta.szlcsc.com/upload/public/pdf/source/20210128/C2671135_A82E49CDEFC20634F2534E8F261E286A.pdf; Supplier: LCSC
U10 = BMI088: Supplier Part: C194919; Manufacturer: Bosch(博世); Supplier Footprint: LGA-16; JLCPCB Part Class: 扩展库; Datasheet: https://atta.szlcsc.com/upload/public/pdf/source/20180628/C194919_66CCF125FF968C218A4D358C68AC68D6.pdf; Supplier: LCSC
U11 = IST8310: Supplier Part: C9900047266; Supplier Footprint: LGA-16; Supplier: LCSC
U19 = PMBT3904: Supplier Part: C5278868; Manufacturer: PAKER(派克微); Supplier Footprint: SOT-23; JLCPCB Part Class: Extended Part; Supplier: LCSC
U25 = SGM3157: 开关电路:-;; LCSC Part Name: 二选一模拟开关电路; Supplier Part: C394901; Manufacturer: UMW(广东友台半导体); Supplier Footprint: SC-70-6; JLCPCB Part Class: 扩展库; Datasheet: https://atta.szlcsc.com/upload/public/pdf/source/20220825/163C0318ED3C3969CBD04552300499AD.pdf; Supplier: LCSC
U27 = 20009-UCAF001-X: LCSC Part Name: TYPE C; Supplier Part: C3148200; Manufacturer: MINTRON(明硕); Supplier Footprint: SMD; JLCPCB Part Class: 扩展库; Datasheet: https://atta.szlcsc.com/upload/public/pdf/source/20220705/4C04992B6F70FB490BC74B4779796E6C.pdf; Supplier: LCSC
U29 = ESP32-S3-WROOM-1U-N8: LCSC Part Name: 通用型Wi-Fi+低功耗蓝牙MCU模组; Supplier Part: C2980297; Manufacturer: ESPRESSIF(乐鑫); Supplier Footprint: SMD,18x19.2mm; JLCPCB Part Class: Extended Part; Datasheet: https://atta.szlcsc.com/upload/public/pdf/source/20220628/A2AC12B3C87735CAEB7EBE2DBE80936C.pdf; Supplier: LCSC
U30 = AP2716QD: 类型:1个N沟道和1个P沟道;漏源电压(Vdss):40V;连续漏极电流(Id):16A;导通电阻(RDS(on)@Vgs,Id):44mΩ@20V,16A;; LCSC Part Name: 1个N沟道和1个P沟道 耐压:40V 电流:16A; Supplier Part: C5443708; Manufacturer: ALLPOWER(铨力); Supplier Footprint: DFN-8(3x3); Datasheet: https://atta.szlcsc.com/upload/public/pdf/source/20230412/9217773636D31B680835B9139E919C7E.pdf; Supplier: LCSC; Type: 1个N沟道和1个P沟道; Drain Source Voltage (Vdss): 40V; Continuous Drain Current (Id): 16A; Drain Source On Resistance (RDS(on)@Vgs,Id): 44mΩ@20V,16A
U31 = SMF28CA_C2943767: 极性:双向;反向截止电压(Vrwm):28V;击穿电压:31.1V;反向漏电流(Ir):1uA;峰值脉冲电流(Ipp)@10/1000μs:4.4A;最大钳位电压:45.4V;; LCSC Part Name: 双向 Vrwm:28V; Supplier Part: C2943767; Manufacturer: GOODWORK(固得沃克); Supplier Footprint: SOD-123FL; JLCPCB Part Class: 扩展库; Datasheet: https://atta.szlcsc.com/upload/public/pdf/source/20220524/AA0A0E50DAB96579C66583AA0A8CF024.pdf; Supplier: LCSC; Polarity: 双向; Reverse Stand-Off Voltage (Vrwm): 28V; Breakdown Voltage: 31.1V; Reverse Leakage Current (Ir): 1uA; Peak Pulse Current (Ipp)@10/1000μs: 4.4A; Maximum Clamping Voltage: 45.4V
X10-X12 = GH125-S02DCA-00: 参考系列:-;间距:1.25mm;插针结构:1x2P;排数:1;每排PIN数:2;行距:-;公母:公型插针;安装方式:卧贴;额定电流:1A;工作温度范围:-25℃~+85℃;; LCSC Part Name: GH1.25卧式贴片 带扣; Supplier Part: C2886765; Manufacturer: JS(钜硕电子); Supplier Footprint: SMD,P=1.25mm; JLCPCB Part Class: 扩展库; Datasheet: https://atta.szlcsc.com/upload/public/pdf/source/20210818/CD11791E5ED3EDF45A7009E9C8A2BD4C.pdf; Supplier: LCSC; Pitch: 1.25mm; Pins Structure: 1x2P; Number of Rows: 1; Number of PINs Per Row: 2; Gender: 公型插针; Mounting Style: 卧贴; Current Rating (Max): 1A; Operating Temperature Range: -25℃~+85℃
X13 = X322525MOB4SI: 频率:25MHz;频率公差:±10ppm;负载电容:12pF;; LCSC Part Name: 25MHz ±10ppm 12pF YSX321SL; Supplier Part: C9006; Manufacturer: YXC(扬兴晶振); Supplier Footprint: SMD3225-4P; JLCPCB Part Class: 基础库; Datasheet: https://atta.szlcsc.com/upload/public/pdf/source/20210329/C112971_1F611BDC486E193C1706F6D8EB5AA189.pdf; Supplier: LCSC; Crystal Type: 贴片无源晶振; Frequency Tolerance: ±10ppm; Frequency Stability: ±30ppm; Load Capacitance: 12pF; Operating Temperature: -40℃~+85℃
X15 = GH125-S03DCA-00: 参考系列:-;间距:1.25mm;插针结构:1x3P;排数:1;每排PIN数:3;行距:-;公母:公型插针;安装方式:卧贴;额定电流:1A;工作温度范围:-25℃~+85℃;; LCSC Part Name: GH1.25卧式贴片 带扣; Supplier Part: C2886766; Manufacturer: JS(钜硕电子); Supplier Footprint: SMD,P=1.25mm; JLCPCB Part Class: Extended Part; Datasheet: https://atta.szlcsc.com/upload/public/pdf/source/20210818/CD11791E5ED3EDF45A7009E9C8A2BD4C.pdf; Supplier: LCSC; Pitch: 1.25mm; Pins Structure: 1x3P; Number of Rows: 1; Number of PINs Per Row: 3; Gender: 公型插针; Mounting Style: 卧贴; Current Rating (Max): 1A; Operating Temperature Range: -25℃~+85℃
X16 X18 X19 = GH125-S04CCA-00: 参考系列:-;间距:1.25mm;插针结构:1x4P;排数:1;每排PIN数:4;行距:-;公母:公型插针;安装方式:立贴;额定电流:1A;工作温度范围:-25℃~+85℃;; LCSC Part Name: GH1.25立式贴片 带扣; Supplier Part: C2886782; Manufacturer: JS(钜硕电子); Supplier Footprint: SMD,P=1.25mm; JLCPCB Part Class: Extended Part; Datasheet: https://atta.szlcsc.com/upload/public/pdf/source/20210818/35C7AE18760A04DD9417CB3CEC0962A3.pdf; Supplier: LCSC; Pitch: 1.25mm; Pins Structure: 1x4P; Number of Rows: 1; Number of PINs Per Row: 4; Gender: 公型插针; Mounting Style: 立贴; Current Rating (Max): 1A; Operating Temperature Range: -25℃~+85℃
X17 = GH125-S06CCA-00: 参考系列:-;间距:1.25mm;插针结构:1x6P;排数:1;每排PIN数:6;行距:-;公母:公型插针;安装方式:立贴;额定电流:1A;工作温度范围:-25℃~+85℃;; LCSC Part Name: GH1.25立式贴片 带扣; Supplier Part: C2886784; Manufacturer: JS(钜硕电子); Supplier Footprint: SMD,P=1.25mm; JLCPCB Part Class: Extended Part; Datasheet: https://atta.szlcsc.com/upload/public/pdf/source/20210818/35C7AE18760A04DD9417CB3CEC0962A3.pdf; Supplier: LCSC; Pitch: 1.25mm; Pins Structure: 1x6P; Number of Rows: 1; Number of PINs Per Row: 6; Gender: 公型插针; Mounting Style: 立贴; Current Rating (Max): 1A; Operating Temperature Range: -25℃~+85℃

## Nets
+3.3V: BUZZER3.1(+) C14.2 C18.2 C75.2 C106.2 C107.2 C108.2 C109.2 C110.2 C111.2 C112.2 C118.1 C119.2 C120.2 C121.2 C122.2 C123.2 D8.1(K) D9.2 L2.2 LED2.2(A) LED3.2(A) LED4.2(+) LED5.2(A) R16.1 R119.2 R120.2 R121.2 R144.2 R146.2 R182.2 U6.B2(VBAT) U6.D2(VDD) U6.F4(VDD) U6.F5(VDD) U6.F6(VDD33USB) U6.H1(VDDA) U6.K1(VDD) U10.3(VDD) U10.11(VDDIO) U11.2(AVDD) U11.13(DVDD) U25.5(VCC) U29.2(3V3) X16.1 X17.1
+5V: C8.2 C13.2 C15.2 C16.2 C17.2 C113.1 C114.1 C115.1 C117.2 CN5.1 CN15.4 CN16.4 CN17.4 H4.2 H5.2 H6.2 H7.2 H8.2 H9.2 H10.2 L1.1 LED6.3(VDD) LED7.1(+) LED7.3(+) R9.2 R13.1 R177.2 R178.2 R179.2 R180.2 U2.3(IN) U2.7(EN) U7.3(VCC) U8.3(VCC) U9.3(VCC) U27.A4(VBUS) U27.A9(VBUS) U27.B4(VBUS) U27.B9(VBUS) X18.1 X19.1
+24V: C127.1 R11.2 R188.2 R196.2 U1.4(IN) U1.5(IN) U1.6(IN) U30.5(D1) U30.6(D1) U30.10(D1)
+24V_BAT: C125.2 C126.2 CN11.2 Q7.2(E) R190.2 R191.2 R192.2 U30.3(S1) U31.2
GND: C12.1 C13.1 C15.1 C16.1 C17.1 C18.1 C36.1 C37.2 C48.2 C49.1 C75.1 C85.1 C96.1 C104.1 C105.1 C106.1 C107.1 C108.1 C109.1 C110.1 C111.1 C112.1 C113.2 C114.2 C115.2 C117.1 C118.2 C119.1 C120.1 C121.1 C122.1 C123.1 C124.1 C127.2 C130.1 CN5.3 CN5.4 CN15.3 CN15.5 CN15.6 CN16.3 CN16.5 CN16.6 CN17.3 CN17.5 CN17.6 D9.1 D10.2(A) H4.1 H5.3 H6.3 H7.3 H8.3 H9.3 H10.3 KEY1.0 KEY1.2 KEY2.0 KEY2.2 LED6.1(GND) Q4.2(S) Q5.2(S) Q6.2 R10.1 R12.1 R15.1 R18.1 R118.1 R137.1 R138.2 R141.1 R142.1 R143.1 R189.1 R194.1 R197.1 SW7.1 SW8.1 U1.1(GND) U1.3(GND) U2.4(PGND) U2.8(SGND) U2.9(GND) U6.C2(VSS) U6.E4(VSS) U6.E5(VSS) U6.E6(VSS) U6.G1(VSSA) U6.J1(VSS) U7.2(GND) U7.8(S) U8.2(GND) U8.8(S) U9.2(GND) U9.8(S) U10.4(GNDA) U10.6(GNDIO) U10.7(PS) U11.9(VSS) U11.11(VSS) U19.2(E) U25.2(GND) U27.1 U27.2 U27.3 U27.4 U27.A1(GND) U27.A12(GND) U27.B1(GND) U27.B12(GND) U29.1(GND) U29.40(GND) U29.41(GND) U30.1(S2) X10.3 X10.4 X11.3 X11.4 X12.3 X12.4 X13.2(GND) X13.4(GND) X15.1 X15.4 X15.5 X16.2 X16.5 X16.6 X17.2 X17.7 X17.8 X18.2 X18.5 X18.6 X19.2 X19.5 X19.6
GND_BAT: C125.1 C126.1 C128.1 CN11.1 D11.2(A) U30.7(D2) U30.8(D2) U30.9(D2) U31.1
ADC_BAT: C124.2 D9.3 R188.1 R189.2 U6.H3(PA5)
BOOT0: R118.2 U6.D5(BOOT0)
BS: C7.1 L1.2 U1.2(LX)
CAN1_RXD: U6.B4(PB8) U9.4(RXD)
CAN1_TXD: U6.A4(PB9) U9.1(TXD)
CAN1H: R79.2 U9.7(CANH) X12.2
CAN1L: R79.1 U9.6(CANL) X12.1
CAN2_RXD: U6.C5(PB5) U8.4(RXD)
CAN2_TXD: U6.B5(PB6) U8.1(TXD)
CAN2H: R80.2 U8.7(CANH) X11.2
CAN2L: R80.1 U8.6(CANL) X11.1
CAN3_RXD: U6.K10(PD12) U7.4(RXD)
CAN3_TXD: U6.J10(PD13) U7.1(TXD)
CAN3H: R81.2 U7.7(CANH) X10.2
CAN3L: R81.1 U7.6(CANL) X10.1
CS1_Accel: U6.G3(PA4) U10.14(CSB1)
CS1_Gyro: U6.J4(PB0) U10.5(CSB2)
DBUS: R145.1 U19.1(B)
DIO: R135.2 U6.A10(PA13) U25.4(A)
DIO_C: R135.1 U25.6(Select) U29.29(IO36)
DIO_I: U25.1(B1) U29.28(IO35)
DIO_O: U25.3(B0) U29.24(IO47)
DRDY_IST8310: U6.G6(PE10) U11.15(DRDY)
EN: C96.2 R144.1 U29.3(EN)
ESP_DN: U27.A7(DN1) U27.B7(DN2) U29.13(IO19)
ESP_DP: U27.A6(DP1) U27.B6(DP2) U29.14(IO20)
ESP_LED: LED6.2(DI) U29.25(IO48)
FB: R8.1 R9.1 R10.2 U1.9(FB)
FB5V: C14.1 R15.2 R16.2 U2.1(FB)
GPIO0: SW7.2 U29.27(IO0)
I2C2_SCL: U6.J7(PB10) X16.4
I2C2_SDA: U6.K7(PB11) X16.3
I2C3_SCL: R182.1 U6.D9(PA8) U11.1(SCL)
I2C3_SDA: R121.1 U6.E9(PC9) U11.16(SDA)
INT1_Accel: U6.G4(PC4) U10.16(INT1)
INT1_Gyro: U6.H4(PC5) U10.12(INT3)
KEY: SW8.2 U29.23(IO21)
NG2: D10.1(K) R191.1 U30.2(G2)
NRST: C104.2 KEY2.1 R119.1 U6.E1(NRST) U29.33(IO40)
OSC32_IN: U6.A1(PC14-OSC32_IN)
OSC32_OUT: U6.B1(PC15-OSC32_OUT)
OSC_IN: C49.2 U6.C1(PH0-OSC_IN) X13.3(OSC2)
OSC_OUT: C48.1 U6.D1(PH1-OSC_OUT) X13.1(OSC1)
PA0: H5.1 U6.G2(PA0)
PA1: H6.1 U6.H2(PA1)
PA2: H7.1 U6.J2(PA2)
PA3: H8.1 U6.K2(PA3)
PA6: R147.1 U6.J3(PA6)
PA7: R148.1 U6.K3(PA7)
PA10: R183.1 U6.D10(PA10)
PB1: H9.1 U6.K4(PB1)
PD14: R181.2 U6.H8(PD14)
PD15: H10.1 U6.G8(PD15)
PE9: R184.1 U6.K5(PE9)
PE11: R185.1 U6.H6(PE11)
PG1: R195.2 U30.4(G1)
PG5V: LED1.2(A) U1.11(PG)
RSTN_IST8310: U6.G7(PE14) U11.14(RSTN)
SPI1_MISO: U6.A6(PB4) U10.10(SDO2) U10.15(SDO1)
SPI1_MOSI: U6.D6(PD7) U10.9(SDA/SDI)
SPI1_SCK: U6.A7(PB3) U10.8(SCL/SCK)
SPI4_CS: U6.A2(PC13) X17.6
SPI4_MISO: U6.D3(PE5) X17.4
SPI4_MOSI: U6.E3(PE6) X17.3
SPI4_SCK: U6.A3(PE2) X17.5
SWCLK: U6.A9(PA14) U29.30(IO37)
UART1_RX: R186.2 U6.A5(PB7) U29.35(IO42)
UART1_TX: R187.2 U6.C9(PA9) U29.34(IO41)
UART2_RX: CN15.1 U6.C6(PD6)
UART2_TX: CN15.2 U6.B6(PD5)
UART3_RX: R146.1 U6.B8(PC11) U19.3(C)
UART4_RX: CN16.1 U6.C10(PA11)
UART4_TX: CN16.2 U6.B10(PA12)
UART5_RX: CN17.1 U6.B7(PD2)
UART5_TX: CN17.2 U6.C8(PC12)
UART6_RX: U6.E10(PC7) X19.4
UART6_TX: U6.F10(PC6) X19.3
UART7_RX: U6.H5(PE7) X15.3
UART7_TX: U6.A8(PA15) X15.2
UART8_RX: U6.D4(PE0) X18.4
UART8_TX: U6.C4(PE1) X18.3
UKEY: C105.2 KEY1.1 R120.1 U6.D8(PD0)
$1N2698: C7.2 U1.7(BS)
$1N2865: C8.1 R8.2
$1N3434: C12.2 U1.8(VCC)
$1N3813: L2.1 U2.6(LX)
$1N3995: R13.2 U2.2(PG)
$1N4166: R11.1 R12.2 U1.12(EN)
$1N5989: LED2.1(K) R18.2
$1N12755: R137.2 U27.A5(CC1)
$1N12756: R138.1 U27.B5(CC2)
$1N13588: Q4.1(G) R141.2 R181.1
$1N13591: Q4.3(D) R177.1 R178.1 R179.1 R180.1
$1N13808: CN5.2 Q5.3(D)
$1N13809: Q5.1(G) R142.2 R148.2
$1N14042: H4.3 R145.2
$1N14320: BUZZER3.2 D8.2(A) Q6.3
$1N14321: Q6.1 R143.2 R147.2
$1N18676: C85.2 U11.10(C1)
$1N19697: C37.1 U6.F8(VCAP)
$1N19698: C36.2 U6.E7(VCAP)
$1N21869: LED3.1(K) R183.2
$1N21874: LED4.1(-) R184.2
$1N21879: LED5.1(K) R185.2
$1N21958: LED7.2(-) R187.1
$1N21960: LED7.4(-) R186.1
$1N55737: C128.2 R190.1
$1N56264: D11.1(K) R192.1 R193.1
$1N56426: C129.2 Q7.1(B) R193.2
$1N56574: C129.1 Q7.3(C) R194.2 R195.1
$1N56906: C130.2 R196.1
$1N67088: LED1.1(K) R197.2

Not connected (* = marked no-connect by the designer): CN11 3 4; LED6 4(DO)*; U1 10(ILMT)*; U2 5(NC)*; U6 B3(PE3) B9(PC10) C3(PE4) C7(PD3) D7(PD4) E2(PC2_C) E8(PD1) F1(PC0) F2(PC1) F3(PC3_C) F7(PDR_ON) F9(PC8) G5(PB2) G9(PD11) G10(PB15) H7(PE15) H9(PD10) H10(PB14) J5(PE8) J6(PE12) J8(PB13) J9(PD9) K6(PE13) K8(PB12) K9(PD8); U7 5(NC)*; U8 5(NC)*; U9 5(NC)*; U10 1(INT2)* 2(NC)* 13(INT4)*; U11 3(NC)* 4(NC)* 5(CAD0)* 6(CAD1)* 7(VPP)* 8(NC)* 12(NC)*; U27 A8(SBU1)* B8(SBU2)*; U29 4(IO4) 5(IO5) 6(IO6) 7(IO7) 8(IO15) 9(IO16) 10(IO17) 11(IO18) 12(IO8) 15(IO3) 16(IO46) 17(IO9) 18(IO10) 19(IO11) 20(IO12) 21(IO13) 22(IO14) 26(IO45) 31(IO38) 32(IO39) 36(RXD0) 37(TXD0) 38(IO2) 39(IO1)

## Notes on the sheet
- 24V-5V  MAX12A 28V 加散热长时间8A（8A需要开窗堆锡）
- 5V-3.3V MAX3A
- 电源安全 上电缓启动 防反接 抑制TB48开关寄生参数的40V尖峰
- 电池电压
- 磁力计
- DBUS
- 高速25M
- 按键
- CANFD
- LED
- IMU恒温（可以适当调
  整加热电阻和限流电阻
  注意走线最大电流，现
  版本加热过于缓慢）
- 激光
- 蜂鸣器
- 无线UART指示灯
- 主控STM32F723VGH6 1 Mbyte of Flash 564 Kbytes of RAM 550MHz
- IMU（孤岛避震，保温）
- PWM/IO
- 无线DAP-Link（无法使用Ozone）
